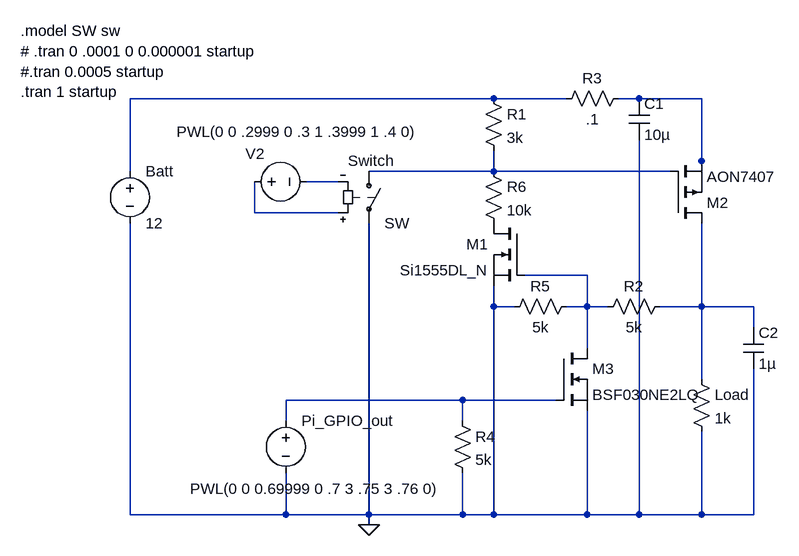
[diagram p0: schematic 12v power section 2.asc]
12v power section 2.asc, the LTspice schematic file:
Version 4.1
SHEET 1 880 724
WIRE -240 48 -800 48
WIRE -128 48 -240 48
WIRE -16 48 -48 48
WIRE 80 48 -16 48
WIRE 80 144 80 48
WIRE -800 160 -800 48
WIRE -240 160 -240 128
WIRE -240 160 -432 160
WIRE 32 160 -240 160
WIRE 80 160 80 144
WIRE -480 176 -528 176
WIRE -608 224 -608 176
WIRE -480 224 -608 224
WIRE -96 320 -192 320
WIRE -240 368 -240 336
WIRE -208 368 -240 368
WIRE -96 368 -96 320
WIRE -96 368 -128 368
WIRE -64 368 -96 368
WIRE 80 368 80 240
WIRE 80 368 16 368
WIRE 160 368 80 368
WIRE 160 400 160 368
WIRE -96 432 -96 368
WIRE 80 480 80 368
WIRE -288 512 -560 512
WIRE -144 512 -288 512
WIRE -560 544 -560 512
WIRE -288 544 -288 512
WIRE -800 688 -800 240
WIRE -560 688 -560 624
WIRE -560 688 -800 688
WIRE -432 688 -432 240
WIRE -432 688 -560 688
WIRE -288 688 -288 624
WIRE -288 688 -432 688
WIRE -240 688 -240 368
WIRE -240 688 -288 688
WIRE -96 688 -96 528
WIRE -96 688 -240 688
WIRE -16 688 -16 112
WIRE -16 688 -96 688
WIRE 80 688 80 560
WIRE 80 688 -16 688
WIRE 160 688 160 464
WIRE 160 688 80 688
WIRE -432 704 -432 688
FLAG -432 704 0
SYMBOL pmos 32 240 M180
SYMATTR InstName M2
SYMATTR Value AON7407
SYMBOL voltage -800 144 R0
SYMATTR InstName Batt
SYMATTR Value 12
SYMBOL res -256 32 R0
SYMATTR InstName R1
SYMATTR Value 3k
SYMBOL sw -432 144 R0
WINDOW 0 -32 0 Left 2
SYMATTR InstName Switch
SYMBOL voltage -624 176 R270
WINDOW 3 77 -104 VRight 2
WINDOW 123 0 0 Left 0
WINDOW 39 0 0 Left 0
WINDOW 0 43 2 VRight 2
SYMATTR Value PWL(0 0 .2999 0 .3 1 .3999 1 .4 0)
SYMATTR InstName V2
SYMBOL res 64 464 R0
SYMATTR InstName Load
SYMATTR Value 1k
SYMBOL nmos -192 240 M0
SYMATTR InstName M1
SYMATTR Value Si1555DL_N
SYMBOL res -112 352 R90
WINDOW 0 0 56 VBottom 2
WINDOW 3 32 56 VTop 2
SYMATTR InstName R5
SYMATTR Value 5k
SYMBOL res 32 352 R90
WINDOW 0 0 56 VBottom 2
WINDOW 3 32 56 VTop 2
SYMATTR InstName R2
SYMATTR Value 5k
SYMBOL voltage -560 528 R0
WINDOW 3 -147 120 Left 2
WINDOW 123 0 0 Left 0
WINDOW 39 0 0 Left 0
SYMATTR Value PWL(0 0 0.69999 0 .7 3 .75 3 .76 0)
SYMATTR InstName Pi_GPIO_out
SYMBOL nmos -144 432 R0
SYMATTR InstName M3
SYMATTR Value BSF030NE2LQ
SYMBOL res -32 32 R90
WINDOW 0 0 56 VBottom 2
WINDOW 3 32 56 VTop 2
SYMATTR InstName R3
SYMATTR Value .1
SYMBOL cap -32 48 R0
SYMATTR InstName C1
SYMATTR Value 10µ
SYMBOL cap 144 400 R0
SYMATTR InstName C2
SYMATTR Value 1µ
SYMBOL res -304 528 R0
SYMATTR InstName R4
SYMATTR Value 5k
SYMBOL res -256 144 R0
SYMATTR InstName R6
SYMATTR Value 10k
TEXT -968 -56 Left 2 !.model SW sw\n# .tran 0 .0001 0 0.000001 startup\n#.tran 0.0005 startup\n.tran 1 startup

The netlist it stands for:
* 12v power section 2.asc
M2 N007 N003 N002 N002 AON7407
V§Batt N001 0 12
R1 N001 N003 3k
Switch N003 0 N005 N004 SW
V2 N005 N004 PWL(0 0 .2999 0 .3 1 .3999 1 .4 0)
R§Load N007 0 1k
M1 P001 N006 0 0 Si1555DL_N
R5 N006 0 5k
R2 N007 N006 5k
V§Pi_GPIO_out N008 0 PWL(0 0 0.69999 0 .7 3 .75 3 .76 0)
M3 N006 N008 0 0 BSF030NE2LQ
R3 N002 N001 .1
C1 N002 0 10µ
C2 N007 0 1µ
R4 N008 0 5k
R6 N003 P001 10k
.model NMOS NMOS
.model PMOS PMOS
.lib standard.mos
.model SW sw
# .tran 0 .0001 0 0.000001 startup
#.tran 0.0005 startup
.tran 1 startup
.backanno
.end